# Altium schematic sheet G.SchDoc
size A
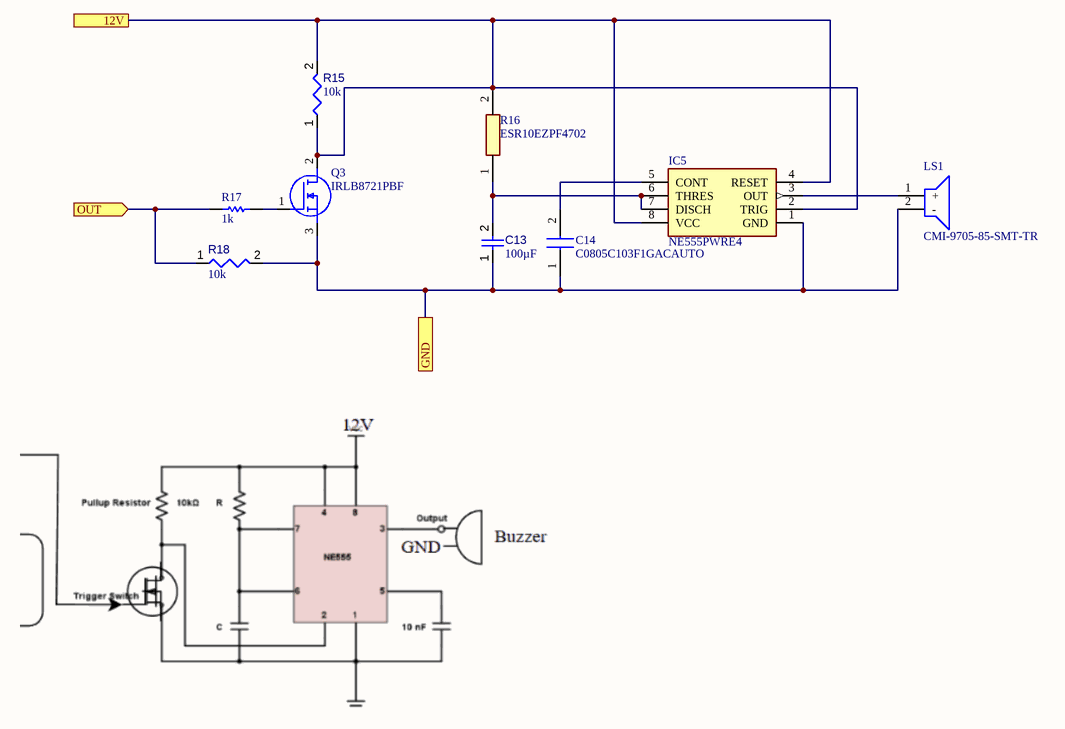
[diagram p0: G.SchDoc]

## Parts
C13  value 100µF  [CAPC0805(2012)145_L]  (hidden comment: Capacitor 100µF +/-20% 6.3V 0805)
C14  C0805C103F1GACAUTO  [C0805]
IC5  NE555PWRE4  [SOP65P640X120-8N]
LS1  CMI-9705-85-SMT-TR  [CMI970585SMTTR]
Q3  IRLB8721PBF  [TO254P483X1016X1994-3P]
R15  value 10k  [RESC2013X50X35ML15T15]  (hidden comment: Resistor 10k +/-1% 0805 125 mW)
R16  ESR10EZPF4702  [RESC2012X65N]
R17  value 1k  [RESC3116X70X50ML13T20]  (hidden comment: Resistor 1k +/-1% 1206 250 mW)
R18  value 10k  [RESC2013X50X35ML15T15]  (hidden comment: Resistor 10k +/-1% 0805 125 mW)

## Ports
12V, GND, OUT (in)

## Nets
12V: IC5.2(TRIG) IC5.4(RESET) IC5.8(VCC) Q3.2(D) R15.1 R15.2 R16.2 ; port 12V
GND: C13.1 C14.1 IC5.1(GND) LS1.2(-) Q3.3(S) R18.2 ; port GND
OUT: R17.1 R18.1 ; port OUT
NetC13_2: C13.2 IC5.6(THRES) IC5.7(DISCH) R16.1
NetC14_2: C14.2 IC5.5(CONT)
NetIC5_3: IC5.3(OUT) LS1.1(+)
NetQ3_1: Q3.1(G) R17.2

## Library data of the parts
C13 = CMP-001-00054-4: Chip Capacitor, 100µF +/-20%, 6.3V, 0805, Thickness 1.45 mm; Tolerance: 10%; Min Operating Temperature: -55°C; Max Operating Temperature: 85°C; Pins: 2; Mounting Technology: SMT; Case/Package: 0805; Voltage Rating: 6.3V
C14 = C0805C103F1GACAUTO: Capacitor; Manufacturer_Name: Yageo Group; Datasheet Link: https://www.yageogroup.com/content/datasheet/asset/file/KEM_C1022_C0G_AUTO_SMD; Height: 1.1mm; Manufacturer_Part_Number: C0805C103F1GACAUTO; Mouser Part Number: 80-C0805C103F1GAUTO; Mouser Price/Stock: https://www.mouser.co.uk/ProductDetail/KEMET/C0805C103F1GACAUTO?qs=SKxV22VtNmdH%252BCKBcUCnZA%3D%3D; Arrow Part Number: C0805C103F1GACAUTO; Arrow Price/Stock: https://www.arrow.com/en/products/c0805c103f1gacauto/kemet-corporation?utm_currency=USD&region=nac
IC5 = NE555PWRE4: Integrated Circuit; Manufacturer_Name: Texas Instruments; Datasheet Link: http://www.ti.com/lit/ds/symlink/ne555.pdf; Height: 1.2mm; Manufacturer_Part_Number: NE555PWRE4; Mouser Part Number: 595-NE555PWRE4; Mouser Price/Stock: https://www.mouser.co.uk/ProductDetail/Texas-Instruments/NE555PWRE4?qs=rLYyFdxB%2Fmr6qUodVTnTjw%3D%3D; Arrow Part Number: NE555PWRE4; Arrow Price/Stock: https://www.arrow.com/en/products/ne555pwre4/texas-instruments
LS1 = CMI-9705-85-SMT-TR: Loudspeaker or Buzzer; Manufacturer_Name: Same Sky; Datasheet Link: https://www.sameskydevices.com/product/resource/CMI-9705-85-SMT-TR.pdf; Height: 5.5mm; Manufacturer_Part_Number: CMI-9705-85-SMT-TR; Mouser Part Number: 490-CMI-9705-85SMTTR; Mouser Price/Stock: https://www.mouser.co.uk/ProductDetail/CUI-Devices/CMI-9705-85-SMT-TR?qs=P1JMDcb91o4Wun0lW9vptg%3D%3D; Arrow Part Number: CMI-9705-85-SMT-TR; Arrow Price/Stock: https://www.arrow.com/en/products/cmi-9705-85-smt-tr/cui-devices?region=nac
Q3 = IRLB8721PBF: MOSFET (N-Channel); Manufacturer_Name: Infineon; Datasheet Link: http://uk.rs-online.com/web/p/products/7259322; Height: 4.83mm; Manufacturer_Part_Number: IRLB8721PBF; Mouser Part Number: 942-IRLB8721PBF; Mouser Price/Stock: https://www.mouser.co.uk/ProductDetail/Infineon-Technologies/IRLB8721PBF?qs=9%252BKlkBgLFf0T58WYx%2FAl5A%3D%3D; Arrow Part Number: IRLB8721PBF; Arrow Price/Stock: https://www.arrow.com/en/products/irlb8721pbf/infineon-technologies-ag?utm_currency=USD&region=europe
R15 R18 = CMP-009-00018-5: Chip Resistor, 10 KOhm, +/- 1%, 125 mW, -55 to 155 degC, 0805 (2012 Metric); Power: 125mW; Voltage Rating: 150V; Tolerance: 1%; Pins: 2; Min Operating Temperature: -55°C; Case/Package: 0805; Max Operating Temperature: 155°C; RoHS Compliant: True; Mounting Technology: SM
R16 = ESR10EZPF4702: Resistor; Manufacturer_Name: ROHM Semiconductor; Datasheet Link: http://uk.rs-online.com/web/p/products/1674355; Height: 0.65mm; Manufacturer_Part_Number: ESR10EZPF4702; Mouser Part Number: 755-ESR10EZPF4702; Mouser Price/Stock: https://www.mouser.com/Search/Refine.aspx?Keyword=755-ESR10EZPF4702
R17 = CMP-009-00011-5: Chip Resistor, 1 KOhm, +/- 1%, 0.25 W, -55 to 155 degC, 1206 (3216 Metric); Voltage Rating: 200V; Power: 250mW; Max Operating Temperature: 155°C; Mounting Technology: SM; Tolerance: 1%; Case/Package: 1206; RoHS Compliant: True; Min Operating Temperature: -55°C; Pins: 2